# EAGLE design mistral_powertrain_breakout0 (EAGLE 7.3.0)
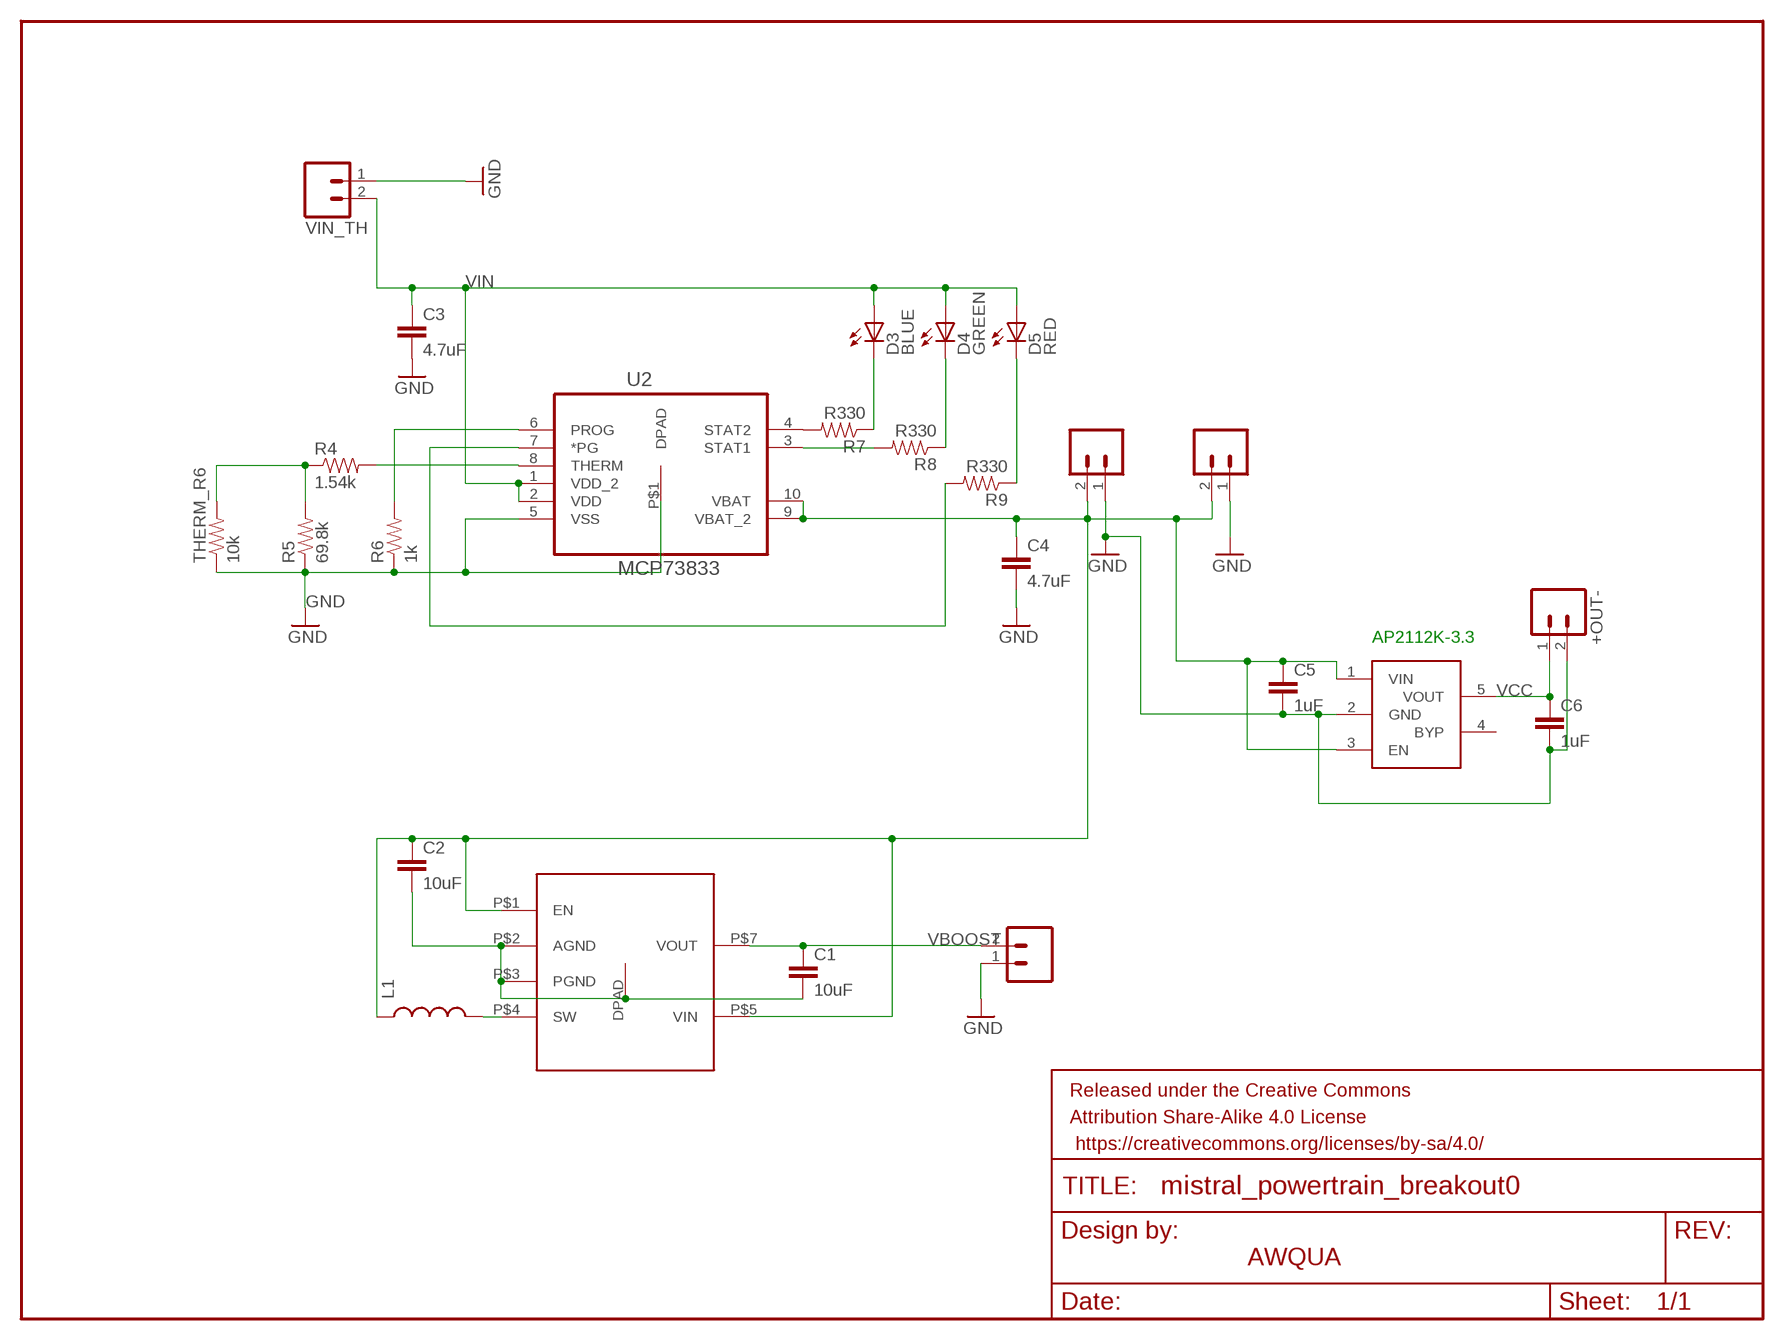
[diagram p0: schematic, sheet 1]

## Parts
+OUT-  M02PTH  [1X02]
C1  10uF  CAP0402-CAP  [0402-CAP]
C2  10uF  CAP0402-CAP  [0402-CAP]
C3  4.7uF  CAP0402-CAP  [0402-CAP]
C4  4.7uF  CAP0402-CAP  [0402-CAP]
C5  1uF  CAP0603-CAP  [0603-CAP]
C6  1uF  CAP0603-CAP  [0603-CAP]
D3  BLUE  LED0603  [LED-0603]
D4  GREEN  LED0603  [LED-0603]
D5  RED  LED0603  [LED-0603]
FRAME1  FRAME-LETTER  [CREATIVE_COMMONS]
JMP  M02PTH  [1X02]
JMP1  M02PTH  [1X02]
JP7  LiPo Battery  M02-JST-2MM-SMT  [JST-2-SMD]
L1  INDUCTOR0805  [0805]
R4  1.54k  RESISTOR0402-RES  [0402-RES]
R5  69.8k  RESISTOR0402-RES  [0402-RES]
R6  1k  RESISTOR0402-RES  [0402-RES]
R7  R330  RESISTOR0402-RES  [0402-RES]
R8  R330  RESISTOR0402-RES  [0402-RES]
R9  R330  RESISTOR0402-RES  [0402-RES]
THERM_R6  10k  RESISTOR0402-RES  [0402-RES]
U2  MCP73833  MCP73833-GPI/UN  [SOP50P490X110-10N]
U$1  DIO6605B  [DIO6605B]
U$2  LP2985  [LP2985]
VIN_TH  M02PTH  [1X02]

## Nets
GND: +OUT-.2 C3.2 C4.2 C5.2 C6.2 JMP1.1 JMP.1 JP7.1 R5.1 R6.1 THERM_R6.1 U2.5(VSS) U2.P$1(DPAD) U$2.2(GND) VIN_TH.1
N$4: C1.2 C2.2 U$1.DPAD(DGND) U$1.P$2(AGND) U$1.P$3(PGND)
N$5: L1.2 U$1.P$4(SW)
N$7: R4.2 U2.8(THERM)
N$8: R4.1 R5.2 THERM_R6.2
N$9: R6.2 U2.6(PROG)
N$10: R7.2 U2.4(STAT2)
N$11: D3.C R7.1
N$12: R8.2 U2.3(STAT1)
N$13: D4.C R8.1
N$15: D5.C R9.1
N$16: R9.2 U2.7(*PG)
VBAT: C2.1 C4.1 C5.1 JMP.2 JP7.2 L1.1 U2.9(VBAT_2) U2.10(VBAT) U$1.P$1(EN) U$1.P$5(VIN) U$2.1(VIN) U$2.3(EN)
VBOOST: C1.1 JMP1.2 U$1.P$7(VOUT)
VCC: +OUT-.1 C6.1 U$2.5(VOUT)
VIN: C3.1 D3.A D4.A D5.A U2.1(VDD_2) U2.2(VDD) VIN_TH.2
Unconnected: U$2.4(BYP)

## Notes on the sheet
- AP2112K-3.3
- AWQUA

## Library data of the parts
+OUT- VIN_TH = SparkFun-Connectors:M02: Standard 2-pin 0.1" header. Use with - straight break away headers ( PRT-00116) - right angle break away headers (PRT-00553) - swiss pins (PRT-00743) - machine pins (PRT-00117) - female headers (PRT-00115) Molex polarized connector foot print use with: PRT-08233 with associated crimp pins and housings. 2.54_SCREWTERM for use with PRT-10571. 3.5mm Screw Terminal footprints for PRT-08084 5mm Screw Terminal footprints for use with PRT-08432
C1-C4 = SparkFun:CAP: Capacitor Standard 0603 ceramic capacitor, and 0.1" leaded capacitor.
C5 C6 = SparkFun-Passives:CAP: Capacitor Standard 0603 ceramic capacitor, and 0.1" leaded capacitor.
D3-D5 = SparkFun:LED: LEDs Standard schematic elements and footprints for 5mm, 3mm, 1206, and 0603 sized LEDs. 5mm - Spark Fun Electronics SKU : COM-00529 (and others)
FRAME1 = SparkFun-Aesthetics:FRAME-LETTER: Schematic Frame Standard 8.5x11 US Letter frame
JMP JMP1 JP7 = SparkFun:M02: Header 2 Standard 2-pin 0.1" header. Use with straight break away headers (SKU : PRT-00116), right angle break away headers (PRT-00553), swiss pins (PRT-00743), machine pins (PRT-00117), and female headers (PRT-00115). Molex polarized connector foot print use with SKU : PRT-08233 with associated crimp pins and housings.
L1 = SparkFun-Passives:INDUCTOR: Inductors Basic Inductor/Choke - 0603 and 1206. Footprints are not proven and vary greatly between part numbers. INDUCTOR POWER 3.3UH 4.0A SMD 0.197" L x 0.197" W x 0.177" H (5.00mm x 5.00mm x 4.50mm)
R4-R9 THERM_R6 = SparkFun:RESISTOR: Resistor Basic schematic elements and footprints for 0603, 1206, and PTH resistors.
U2 = MCP73833-GPI_UN:MCP73833-GPI/UN: LI-ION/LI-POLY CONTROLLERS; AVAILABILITY: Good; DESCRIPTION: Linear Charge Management Controller Li-Ion/Li-Pol 1mA 4.2V/4.35V/4.4V/4.5V 10-Pin MSOP Tube; MF: Microchip; MP: MCP73833-GPI/UN; PACKAGE: MSOP-10 Microchip; PRICE: 0.75 USD
U$1 = awqua_eagle_library:DIO6605B
U$2 = awqua_eagle_library:LP2985

## Board
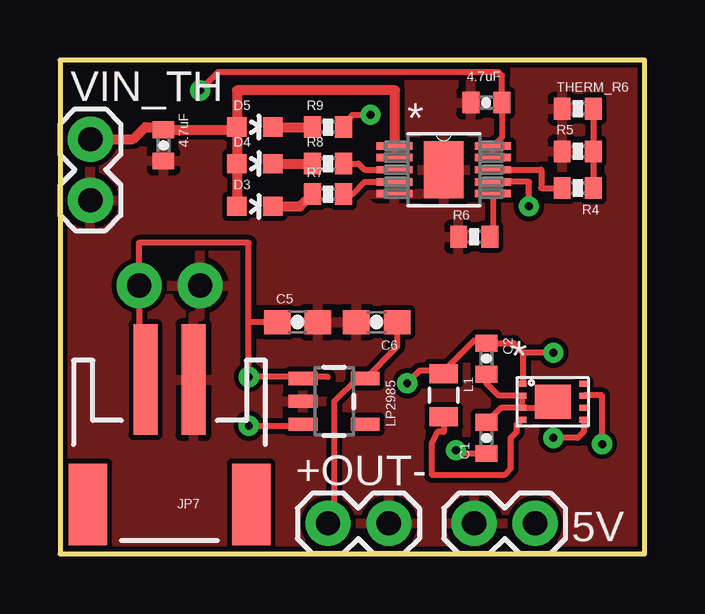
[diagram p1: board, top side]
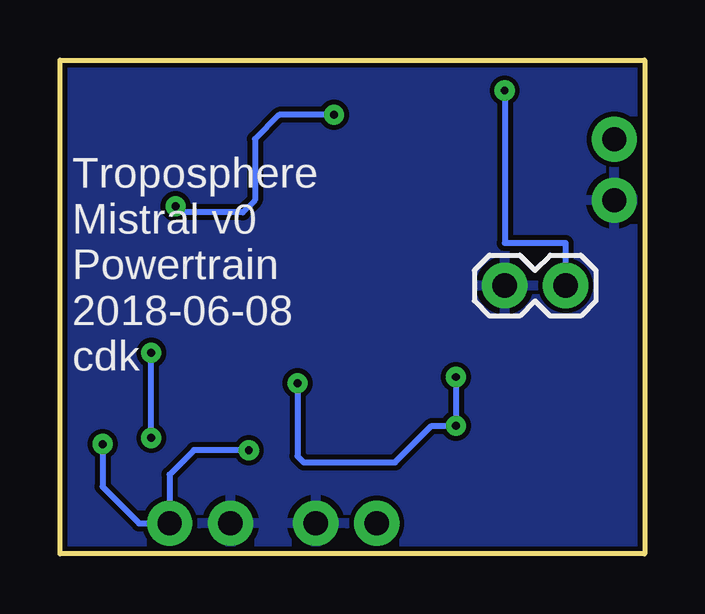
[diagram p2: board, bottom side, seen from below]

Size 24.38 x 20.57 mm. Coordinates in mm from the lower left corner, seen from the top.
Outline: 24.38,0 24.38,20.57 0,20.57 0,0 24.38,0
Copper layers (1*16): Top 0.035mm / dielectric 1.5mm / Bottom 0.035mm
Design rules "SparkFun": minimum track width 8mil, minimum drill 20mil, track to track 8mil, track to pad 8mil, pad to pad 8mil, via to via 8mil, smd to smd 6mil, copper to edge 8mil, drill to drill 8mil, minimum pad ring 12mil, minimum via ring 10mil, stop-mask expansion 4mil, vias tented up to drill 25mil, thermal gap 10mil

### Footprints (pad centres in the part's own frame; a part is rotated, then mirrored left to right if it is on the bottom)
1X02 = drill 1.016 pad 1.88: 1 0,0; 2 2.54,0
0402-CAP = smd 0.7 x 0.9: 1 -0.65,0; 2 0.65,0
0603-CAP = smd 1.1 x 1: 1 -0.85,0; 2 0.85,0
LED-0603 = smd 0.8 x 0.8: A 0,-0.75; C 0,0.75
JST-2-SMD = smd 1 x 4.6: 1 -1,-3.7; 2 1,-3.7 | smd 1.6 x 3.4: NC1 -3.4,1.5; NC2 3.4,1.5
0805 = smd 0.8 x 1.2: 1 -0.9,0; 2 0.9,0
0402-RES = smd 0.7 x 0.9: 1 -0.65,0; 2 0.65,0
SOP50P490X110-10N = smd 1.499 x 0.305: 1 -2.057,0.991; 2 -2.057,0.508; 3 -2.057,0; 4 -2.057,-0.508; 5 -2.057,-0.991; 6 2.057,-0.991; 7 2.057,-0.508; 8 2.057,0; 9 2.057,0.508; 10 2.057,0.991 | smd 1.65 x 2.39: P$1 0,0
DIO6605B = smd 1.5 x 1.4: DPAD 1.5,1 | smd 0.4 x 0.25: P$1 0.2,1.75; P$2 0.2,1.25; P$3 0.2,0.75; P$4 0.2,0.25; P$5 2.8,0.25; P$6 2.8,0.75; P$7 2.8,1.25; P$8 2.8,1.75
LP2985 = smd 0.55 x 1.2: 1 0.32,-0.03; 2 1.27,-0.03; 3 2.22,-0.03; 4 2.22,2.57; 5 0.32,2.57

### Placement (x,y rotation side)
+OUT-  11.18,1.27 0 top
C1  17.78,4.83 90 top
C2  17.78,8.13 270 top
C3  4.32,17.02 270 top
C4  17.78,18.8 180 top
C5  9.91,9.65 0 top
C6  13.21,9.65 180 top
D3  8.13,14.48 270 top
D4  8.13,16.26 270 top
D5  8.13,17.78 270 top
FRAME1  -12.7,-19.56 0 top  (outside the outline)
JMP  5.84,11.18 0 bottom
JMP1  17.27,1.27 0 top
JP7  4.57,3.56 180 top
L1  16,6.6 270 top
R4  21.59,15.24 180 top
R5  21.59,16.76 0 top
R6  17.27,13.21 0 top
R7  11.18,14.99 0 top
R8  11.18,16.26 0 top
R9  11.18,17.78 0 top
THERM_R6  21.59,18.54 0 top
U2  16,16 0 top
U$1  19.05,5.33 0 top
U$2  10.16,7.62 270 top
VIN_TH  1.27,14.73 90 top

### Tracks (layer width: path | path; a pad name or v marks a point on that pad's centre or on a via)
GND
  pour Bottom: -8.89,50.8 48.26,50.8 48.26,-17.78 -8.89,-17.78
  pour Top: -7.62,49.53 50.8,49.53 50.8,-19.05 -7.62,-19.05
N$4
  Top 0.254: C2.2 17.78,7.11 18.29,6.6 19.23,6.6 U$1.P$2 U$1.P$3 | U$1.P$3 18.39,6.08 C1.2 | U$1.P$3 20.3,6.08 U$1.DPAD
N$5
  Top 0.254: L1.2 16,5.08 15.75,5.08 15.49,4.57 15.49,3.3 18.54,3.3 18.8,3.56 18.8,4.83 19.05,5.08 19.05,5.38 U$1.P$4
N$7
  Top 0.254: U2.8 20.07,16 20.07,15.24 R4.2
N$8
  Top 0.254: THERM_R6.2 R5.2 R4.1
N$9
  Top 0.254: U2.6 18.06,13.55 R6.2
N$10
  Top 0.254: R7.2 12.19,14.99 12.7,15.49 U2.4
N$11
  Top 0.406: D3.C 10.02,14.48 R7.1
N$12
  Top 0.254: R8.2 12.45,16.26 12.7,16 U2.3
N$13
  Top 0.406: D4.C R8.1
N$15
  Top 0.406: D5.C R9.1
N$16  (via drill 0.33)
  Top 0.254: R9.2 12.19,18.29 v12.95,18.29 | v19.56,14.48 19.56,15.49 U2.7
  Bottom 0.254: v12.95,18.29 15.24,18.29 16.26,17.27 16.26,14.73 16.76,14.22 19.56,14.22 v19.56,14.48
VBAT  (via drill 0.33)
  Top 0.254: U2.9 U2.10 18.43,17.36 C4.1 18.43,19.92 18.29,20.07 6.6,20.07 v5.84,19.3 | 9.14,9.74 C5.1 7.87,9.65 | JP7.2 3.3,7.53 JMP.2 3.3,12.95 7.87,12.95 7.87,9.65 | 10.16,7.33 U$2.1 | U$2.1 10.09,7.37 v7.87,7.37 7.87,9.65 | v7.87,5.33 10.06,5.33 U$2.3 10.16,5.37 | 11.18,7.37 10.2,7.37 U$2.1 | L1.1 16,7.62 | 16,7.62 17.27,8.89 17.67,8.89 C2.1 18.91,8.78 19.3,8.38 | 19.3,8.38 19.3,7.14 U$1.P$1 | U$1.P$5 21.85,5.09 21.59,4.83 v20.57,4.83 | v20.57,8.38 19.3,8.38 | 16,7.62 14.99,7.62 v14.48,7.11
  Bottom 0.254: v7.87,7.37 v7.87,5.33 8.89,5.33 10.41,3.81 14.22,3.81 14.48,4.06 v14.48,7.11 | v20.57,4.83 v20.57,8.38 | v5.84,19.3 5.84,12.95 3.3,12.95 JMP.2
VBOOST  (via drill 0.33)
  Top 0.254: v22.61,4.57 22.61,6.6 21.87,6.6 U$1.P$7 | C1.1 16.91,4.18 v16.51,4.32
  Bottom 0.254: v22.61,4.57 22.61,2.79 21.08,1.27 JMP1.2 19.81,3.3 18.8,4.32 v16.51,4.32
VCC
  Top 0.254: C6.1 14.06,8.63 U$2.5 12.38,7.3 11.43,6.35 11.43,1.52 +OUT-.1
VIN
  Top 0.254: U2.1 U2.2
  Top 0.406: D5.A 7.38,19.3 13.97,19.3 13.97,16.99 U2.1 | D5.A D4.A D3.A | VIN_TH.2 3.05,17.27 3.56,17.78 4.21,17.78 C3.1 7.37,17.67 7.37,17.78 7.27,17.89 D5.A | 7.27,17.67 D5.A

### Text on the board
tPlace: * | * | 5V
bPlace: Troposphere / Mistral v0 / Powertrain / 2018-06-08 / cdk
tNames: AWQUA